# Altium schematic sheet TopLevelDesign.SchDoc
size B; SheetNumber: 1; SheetTotal: 4
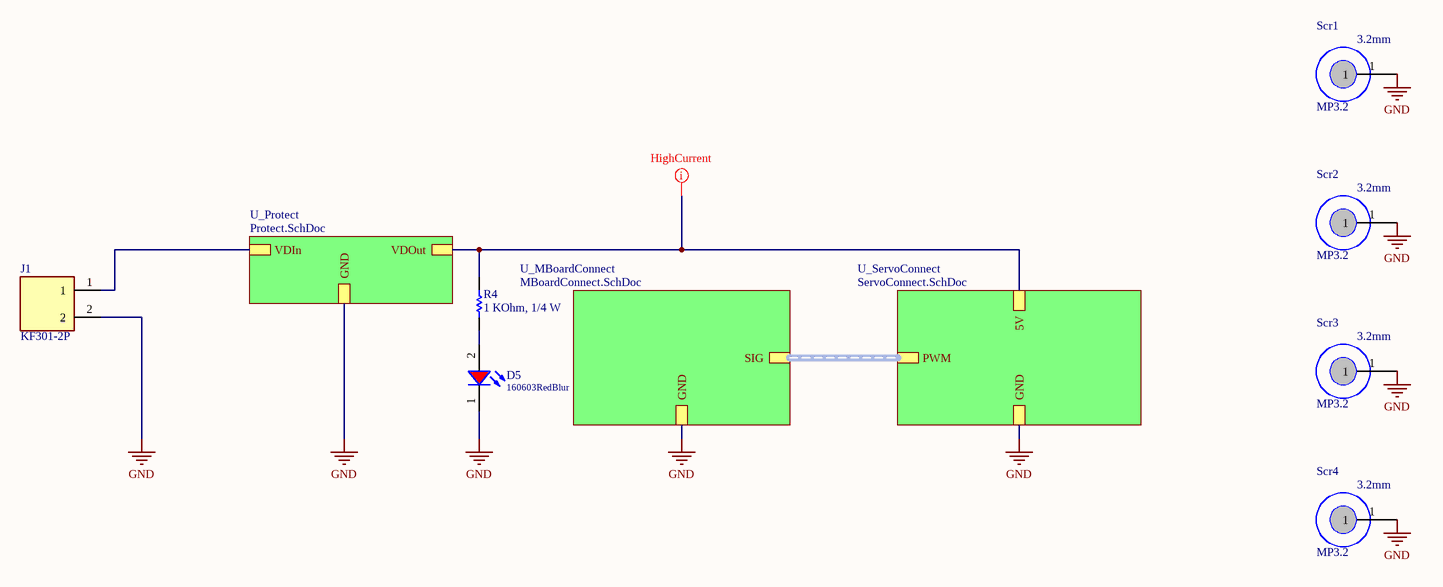
[diagram p0: TopLevelDesign.SchDoc]

## Parts
D5  160603RedBlur  [WL-SMCW_0603_H=0.7mm]
J1  KF301-2P  [HANDSON_KF301-2P]
R4  value 1 KOhm, 1/4 W  [resistor_0603]  (hidden comment: 0006031021)
Scr1  MP3.2  [MP3.2]
Scr2  MP3.2  [MP3.2]
Scr3  MP3.2  [MP3.2]
Scr4  MP3.2  [MP3.2]

## Sub-sheets
U_MBoardConnect = MBoardConnect.SchDoc: SIG (harness ServoConnector), GND
U_Protect = Protect.SchDoc: VDIn, GND, VDOut
U_ServoConnect = ServoConnect.SchDoc: 5V, GND, PWM (harness ServoConnector)

## Nets
GND: D5.1(K) J1.2 Scr1.1 Scr2.1 Scr3.1 Scr4.1 ; sheet U_MBoardConnect/GND, sheet U_ServoConnect/GND, sheet U_Protect/GND
NetD5_2: D5.2(A) R4.1
NetJ1_1: J1.1 ; sheet U_Protect/VDIn
NetR4_2: R4.2 ; sheet U_ServoConnect/5V, sheet U_Protect/VDOut

## Buses and harness runs
harness sheet U_MBoardConnect/SIG = sheet U_ServoConnect/PWM

## Layout directives
rule Width Constraint [Pref Width = 50mil    Min Width = 50mil    Max Width = 100mil]: NetR4_2

## Notes on the sheet
- (in symbol CMP-143-000000-1) 3.2mm

## Library data of the parts
D5 = CMP-004-00093-1: WL-SMCW SMT Mono-color Chip LED Blur, size 0603, Red, 2V, 140deg; Value: Red, 2V; ComponentLink2URL: https://www.mouser.vn/ProductDetail/ROHM-Semiconductor/CSL1901VW1?qs=vvQtp7zwQdNmrXZcE27xEA%3D%3D; Supplier 2 URL: https://www.digikey.com/en/products/detail/rohm-semiconductor/SML-D12U8WT86/1641799; Pins: 2; Supplier 2 Name: Digi-Key; ComponentLink1Description: Datasheet link; ComponentLink3URL: https://www.digikey.com/en/products/detail/rohm-semiconductor/SML-D12U8WT86/1641799; Supplier 1 Name: Mouser; Supplier 1 SN: 755-CSL1901VW1; Size: 0603; ComponentLink1URL: N/A; Source: WL-SMCW_0603.SchLib; ComponentLink3Description: Supplier 2 URL; Type: Blur; Design Item ID: 160603RedBlur; Component Type: Standard; ComponentLink4URL: N/A; Supplier 3 Name: ICDayRoi; Supplier 3 SN: N/A; Color: Red; Supplier 1 URL: https://www.mouser.vn/ProductDetail/ROHM-Semiconductor/CSL1901VW1?qs=vvQtp7zwQdNmrXZcE27xEA%3D%3D; Supplier 2 SN: 511-1580-2-ND; ComponentLink2Description: Supplier 1 URL; Supplier 3 URL: N/A; ComponentLink4Description: Supplier 3 URL
J1 = CMP-118-000001-1: 2 Pin Terminal Block 5mm Pitch; MP: KF301-2P; Design Item ID: KF301-2P; Value: *; Price: None; Package: None; Availability: Unavailable; Source: KF301-2P.SchLib
R4 = CMP-009-00186-1: RES, size 0603, 1 KOhm, 1/4 W; Manufacture  SN: OEM; Rated Power: 1/4 W; Resistance Tolerance: +/-1%; Supplier 1 SN: 71-RCS06031K00FKEA; ComponentLink4Description: Supplier 3 URL; ComponentLink2Description: Supplier 1 URL; Supplier 3 SN: N/A; Supplier 2 Name: Digi-Key; ComponentLink3Description: Supplier 2 URL; Pins: 2; ComponentLink4URL: N/A; Source: Resistor_0603.SchLib; ComponentLink3URL: https://www.digikey.com/en/products/detail/yageo/SR0603FR-7T1KL/9373103; Supplier 2 SN: YAG5829TR-ND YAG5829CT-ND YAG5829DKR-ND; Supplier 2 URL: https://www.digikey.com/en/products/detail/yageo/SR0603FR-7T1KL/9373103; Supplier 1 Name: Mouser; Component Type: Standard; ComponentLink2URL: N/A; Size: 0603; Supplier 1 URL: https://www.mouser.vn/ProductDetail/Vishay-Dale/RCS06031K00FKEA?qs=sGAEpiMZZMvdGkrng054t9clqp6gtJJdzI9PGMrTQi4RTIuHToNahw%3D%3D; Supplier 3 URL: N/A; Design Item ID: 0006031021; Mounting Technology: SMT; ComponentLink1URL: https://www.yageo.com/upload/media/product/productsearch/datasheet/rchip/PYu-SR_20105_RoHS_L_10.pdf; ComponentLink1Description: Datasheet link; Supplier 3 Name: thegioiic; Manufacture  Name: OEM
Scr1-Scr4 = CMP-143-000000-1: Component Type: Standard; Pin Count: 1; Source: MP_3P2.SchLib; Design Item ID: MP3.2